# EAGLE design _FARTSNIFFER (EAGLE 6.1)
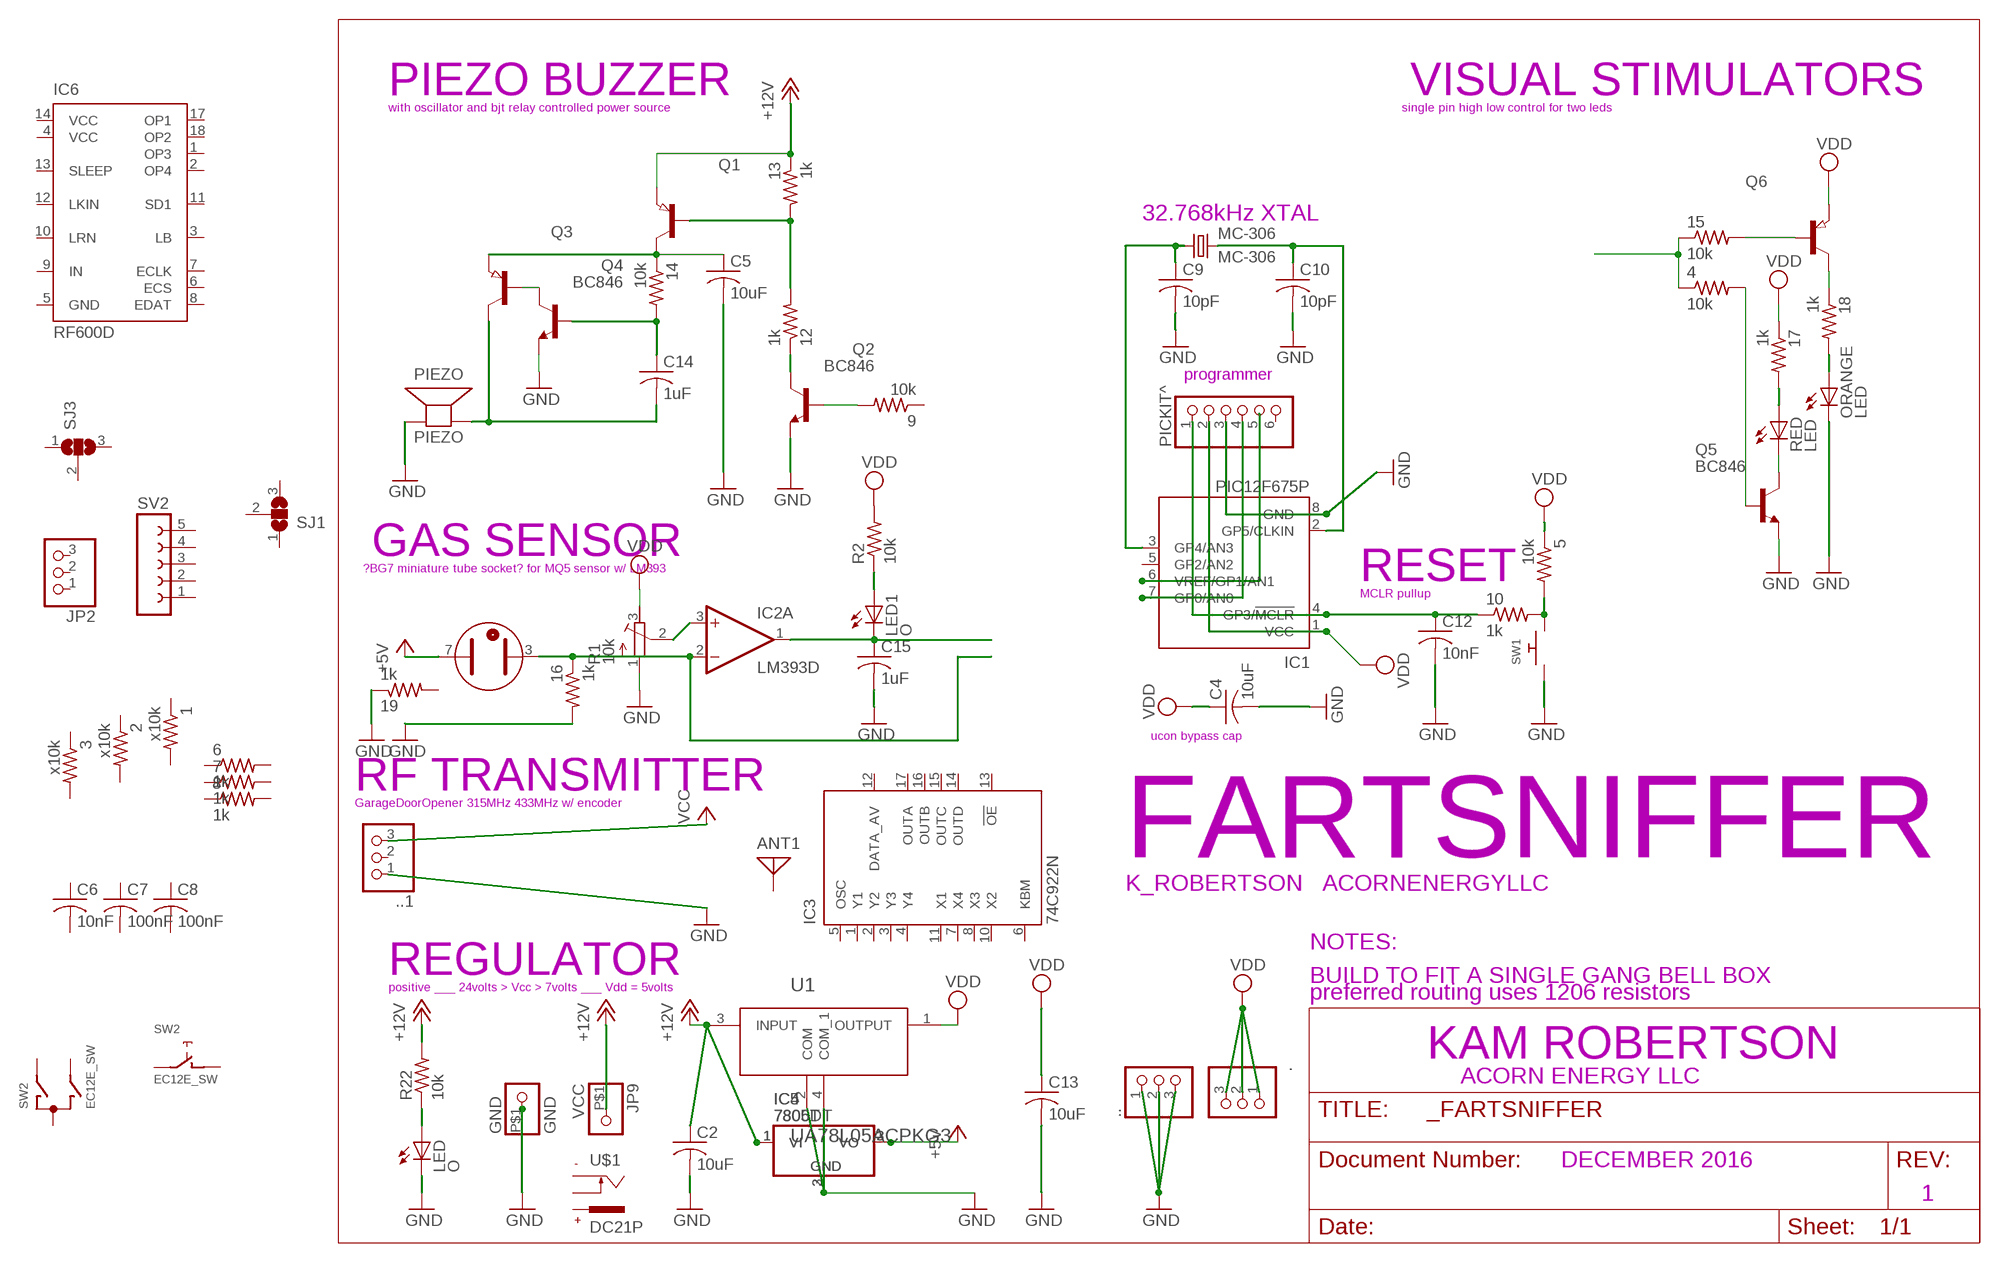
[diagram p0: schematic, sheet 1]

## Parts
1  x10k  R-US_R1206  [R1206]
2  x10k  R-US_R1206  [R1206]
3  x10k  R-US_R1206  [R1206]
4  10k  R-US_R1206  [R1206]
5  10k  R-US_R1206  [R1206]
6  1k  R-US_R1206  [R1206]
7  1k  R-US_R1206  [R1206]
8  1k  R-US_R1206  [R1206]
9  10k  R-US_R1206  [R1206]
10  1k  R-US_R1206  [R1206]
12  1k  R-US_R1206  [R1206]
13  1k  R-US_R1206  [R1206]
14  10k  R-US_R1206  [R1206]
15  10k  R-US_R1206  [R1206]
16  1k  R-US_R1206  [R1206]
17  1k  R-US_R1206  [R1206]
18  1k  R-US_R1206  [R1206]
19  1k  R-US_R1206  [R1206]
.  PINHD-1X3CB  [1X03-CLEANBIG]
..  PINHD-1X3CB  [1X03-CLEANBIG]
..1  PINHD-1X3CB  [1X03-CLEANBIG]
ANT1  ANTENNA  [PAD-01]
C2  10uF  C-USC1210  [C1210]
C4  10uF  C-USC1210  [C1210]
C5  10uF  C-USC1210  [C1210]
C6  10nF  C-USC1210  [C1210]
C7  100nF  C-USC1210  [C1210]
C8  100nF  C-USC1210  [C1210]
C9  10pF  C-USC1210  [C1210]
C10  10pF  C-USC1210  [C1210]
C12  10nF  C-USC1210  [C1210]
C13  10uF  C-USC1210  [C1210]
C14  1uF  C-USC1210  [C1210]
C15  1uF  C-USC1210  [C1210]
GND  GND  PINHD-1X1-BIGPOGO  [1X1-BIGPOGO]
IC1  PIC12F675P  [DIL8]
IC2  LM393D  [SO08]
IC3  74C922N  [DIL18]
IC4  7806DT  [TO252]
IC5  7805T  [TO220H]
IC6  RF600D  [DIL18]
JP2  PINHD-1X3CB  [1X03-CLEANBIG]
JP9  VCC  PINHD-1X1-BIGPOGO  [1X1-BIGPOGO]
LED  O  LEDCHIPLED_1206  [CHIPLED_1206]
LED1  O  LEDCHIPLED_1206  [CHIPLED_1206]
MC-306  MC-306  [MC-306]
ORANGE  LED  LED5MM  [LED5MM]
PICKIT^  PINHD-1X6LOCK  [1X06-BIGLOCK]
PIEZO  PIEZO  SPEAKER/AL60P  [AL60P]
Q1  PNP-TRANSISTOR_SOT89  [SOT89]
Q2  BC846  [SOT23]
Q3  PNP-TRANSISTOR_SOT89  [SOT89]
Q4  BC846  [SOT23]
Q5  BC846  [SOT23]
Q6  PNP-TRANSISTOR_SOT23  [SOT23]
R1  10k  R-TRIMM64W  [RTRIM64W]
R2  10k  R-US_R1206  [R1206]
R22  10k  R-US_R1206  [R1206]
RED  LED  LED5MM  [LED5MM]
SJ1  SJ2W  [SJ_2]
SJ3  SJ2W  [SJ_2]
ST1  STABI  [MINI_P]
SV2  FE05-1  [FE05-1]
SW1  SWITCH_PUSHBUTTONEVQ-PE  [TACT_PANA-EVQ]
SW2  EC12E_SW  [ALPS_EC12E_SW]
U1  UA78L05ACPKG3  [SOT150P400X160-4N]
U$1  DC21P  [DCSKTP]

## Nets
+5V: IC4.2(VO) IC5.3(VO)
+12V: 13.1 C2.1 IC4.1(VI) IC5.1(VI) JP9.P$1 Q1.3(E) R22.2 U1.3(INPUT)
GND: 16.2 19.1 ..1.1 ...1 ...2 ...3 C2.2 C4.2 C5.2 C9.2 C10.2 C12.2 C13.2 C15.2 GND.P$1 IC1.8(GND) IC4.3(GND) IC5.2(GND) LED.C ORANGE.K(C) PICKIT^.3 PIEZO.2(-) Q2.2(E) Q4.2(E) Q5.2(E) R1.1(A) SW1.P$1 U1.2(COM) U1.4(COM_1)
N$3: 9.2 Q2.1(B)
N$4: 5.2 10.2 SW1.P$2
N$5: 10.1 C12.1 IC1.4(GP3/!MCLR) PICKIT^.1
N$6: IC1.7(GP0/AN0) PICKIT^.4
N$7: IC1.6(VREF/GP1/AN1)
N$8: Q5.3(C) RED.K(C)
N$11: 12.1 Q2.3(C)
N$12: 12.2 13.2 Q1.1(B)
N$14: 4.2 Q5.1(B)
N$15: 18.1 Q6.3(C)
N$16: 15.2 Q6.1(B)
N$17: 4.1 15.1
N$18: 16.1 IC2.2(A:-IN) ST1.3(A)
N$19: IC2.3(A:+IN) R1.2(S)
N$20: LED1.A R2.1
N$21: Q3.1(B) Q4.3(C)
N$22: 14.1 C5.1 Q1.2(C) Q3.3(E)
N$23: 14.2 C14.1 Q4.1(B)
N$24: C15.1 IC2.1(A:OUT) LED1.C
N$28: 18.2 ORANGE.A
N$29: 17.2 RED.A
N$31: C9.1 IC1.3(GP4/AN3) MC-306.1
N$37: C10.1 IC1.2(GP5/CLKIN) MC-306.4
N$40: LED.A R22.1
VCC: ..1.3
VDD: 5.1 17.1 ..1 ..2 ..3 C4.1 C13.1 IC1.1(VCC) PICKIT^.2 Q6.2(E) R1.3(E) R2.2 ST1.7(K) U1.1(OUTPUT) ; supply symbol labelled +5V
VS: C14.2 PIEZO.1(+) Q3.2(C)
Unconnected: 1.1 1.2 2.1 2.2 3.1 3.2 6.1 6.2 7.1 7.2 8.1 8.2 9.1 19.2 ..1.2 ANT1.1 C6.1 C6.2 C7.1 C7.2 C8.1 C8.2 IC1.5(GP2/AN2) IC2.5(B:+IN) IC2.6(B:-IN) IC2.7(B:OUT) IC3.1(Y1) IC3.2(Y2) IC3.3(Y3) IC3.4(Y4) IC3.5(OSC) IC3.6(KBM) IC3.7(X4) IC3.8(X3) IC3.10(X2) IC3.11(X1) IC3.12(DATA_AV) IC3.13(!OE) IC3.14(OUTD) IC3.15(OUTC) IC3.16(OUTB) IC3.17(OUTA) IC6.1(OP3) IC6.2(OP4) IC6.3(LB) IC6.4(VCC) IC6.6(ECS) IC6.7(ECLK) IC6.8(EDAT) IC6.9(IN) IC6.10(LRN) IC6.11(SD1) IC6.12(LKIN) IC6.13(SLEEP) IC6.17(OP1) IC6.18(OP2) JP2.1 JP2.2 JP2.3 PICKIT^.5 PICKIT^.6 SJ1.1 SJ1.2 SJ1.3 SJ3.1 SJ3.2 SJ3.3 SV2.1 SV2.2 SV2.3 SV2.4 SV2.5 SW2.A SW2.B SW2.C SW2.D SW2.E SW2.GND1(G) SW2.GND2(G) U$1.+ U$1.- U$1.C

## Notes on the sheet
- PIEZO BUZZER | VISUAL STIMULATORS
- with oscillator and bjt relay controlled power source | single pin high low control for two leds
- 32.768kHz XTAL
- programmer
- GAS SENSOR
- ?BG7 miniature tube socket? for MQ5 sensor w/ LM393
- RESET
- MCLR pullup
- ucon bypass cap
- RF TRANSMITTER
- GarageDoorOpener 315MHz 433MHz w/ encoder
- FARTSNIFFER
- K_ROBERTSON   ACORNENERGYLLC
- NOTES:
- REGULATOR
- BUILD TO FIT A SINGLE GANG BELL BOX
- positive ___ 24volts > Vcc > 7volts ___ Vdd = 5volts
- preferred routing uses 1206 resistors
- KAM ROBERTSON
- ACORN ENERGY LLC
- DECEMBER 2016
- 1

## Power pins joined to a net without a drawn wire
GND: IC3.9(GND) IC6.5(GND)
V+: IC2.8(P:V+)
V-: IC2.4(P:V-)
VCC: IC3.18(VCC) IC6.14(VCC)

## Library data of the parts
1-10 12-19 R2 R22 = resistor:R-US_: RESISTOR, American symbol
. .. ..1 JP2 = adafruit:PINHD-1X3: PIN HEADER
ANT1 = discrete:ANTENNA: Antenna
C2 C4-C10 C12-C15 = adafruit:C-US: CAPACITOR, American symbol
GND JP9 = adafruit:PINHD-1X1: Pin header 1x1 for 0.1" spacing With round pins
IC1 = microchip:PIC12F675: 8-Pin FLASH-Based 8-Bit CMOS Microcontroller Precision Internal 4 MHz oscillator factory calibrated to ±1% Low Power Features: Standby Current: - 1 nA @ 2.0V, typical Operating Current: - 8.5µA @ 32 kHz, 2.0V, typical - 100µA @ 1 MHz, 2.0V, typical Watchdog Timer Current: - 300 nA @ 2.0V, typical Timer1 oscillator current: - 4µA @ 32 kHz, 2.0V, typical Analog-to-Digital Converter module: - 10-bit resolution - Programmable 4-channel input - Voltage reference input Source: http://www.microchip.com .. 41190E.pdf; MF: MICROCHIP; MPN: PIC12F675-E/P; OC_FARNELL: 9759018; OC_NEWARK: 92C4340
IC2 = linear:LM393: COMPARATOR
IC3 = 74xx-us:74C922: 16-Key Encoder Source: http://www.national.com/ds/MM/MM54C922.pdf#page=1
IC4 IC5 = linear:78*: Positive VOLTAGE REGULATOR Source: http://cache.national.com/ds/LM/LM78L05.pdf http://www.fairchildsemi.com/ds/LM/LM7805.pdf
IC6 = rf-solutions:RF600D: RF / IR Decoder Source: RF600D.pdf; MPN: RF600D; OC_FARNELL: 1200973; OC_NEWARK: 01M8597
LED LED1 ORANGE RED = adafruit:LED: LED OSRAM: - CHIPLED LG R971, LG N971, LY N971, LG Q971, LY Q971, LO R971, LY R971 LH N974, LH R974 LS Q976, LO Q976, LY Q976 LO Q996 - Hyper CHIPLED LW Q18S LB Q993, LB Q99A, LB R99A - SideLED LS A670, LO A670, LY A670, LG A670, LP A670 LB A673, LV A673, LT A673, LW A673 LH A674 LY A675 LS A676, LA A676, LO A676, LY A676, LW A676 LS A679, LY A679, LG A679 - Hyper Micro SIDELED® LS Y876, LA Y876, LO Y876, LY Y876 LT Y87S - SmartLED LW L88C, LW L88S LB L89C, LB L89S, LG L890 LS L89K, LO L89K, LY L89K LS L896, LA L896, LO L896, LY L896 - TOPLED LS T670, LO T670, LY T670, LG T670, LP T670 LSG T670, LSP T670, LSY T670, LOP T670, LYG T670 LG T671, LOG T671, LSG T671 LB T673, LV T673, LT T673, LW T673 LH T674 LS T676, LA T676, LO T676, LY T676, LB T676, LH T676, LSB T676, LW T676 LB T67C, LV T67C, LT T67C, LS T67K, LO T67K, LY T67K, LW E67C LS E67B, LA E67B, LO E67B, LY E67B, LB E67C, LV E67C, LT E67C LW T67C LS T679, LY T679, LG T679 LS T770, LO T770, LY T770, LG T770, LP T770 LB T773, LV T773, LT T773, LW T773 LH T774 LS E675, LA E675, LY E675, LS T675 LS T776, LA T776, LO T776, LY T776, LB T776 LHGB T686 LT T68C, LB T68C - Hyper Mini TOPLED® LB M676 - Mini TOPLED Santana® LG M470 LS M47K, LO M47K, LY M47K Source: http://www.osram.convergy.de/
MC-306 = crystal:MC-306: kHz RANGE CRYSTAL UNIT SMD Source: MC-306_405_406_E07X.PDF Homepage <http://www.epsontoyocom.co.jp>; MPN: MC-306 60.0KHZ 100PPM ,12.5PF; OC_FARNELL: 1278040; OC_NEWARK: 31M5576
PICKIT^ = adafruit:PINHD-1X6: PIN HEADER
PIEZO = adafruit:SPEAKER: SPEAKER Source: Buerklin Added PS12 (for part # PS1240 piezo) http://www.ladyada.net/library/pcb/eaglelibrary.html
Q1 Q3 Q6 = semicon-smd-ipc:PNP-TRANSISTOR_: PNP TRANSISTOR
Q2 Q4 Q5 = transistor-neu-to92:BC846: NPN TRANSISTOR
R1 = resistor:R-TRIMM: Trimm resistor
SJ1 SJ3 = jumper:SJ2W: SMD solder JUMPER
ST1 = valves2:STABI
SV2 = con-lsta:FE05-1: FEMALE HEADER; OC_FARNELL: unknown; OC_NEWARK: unknown
SW1 = adafruit:SWITCH_PUSHBUTTON: Buttons SOFTTOUCHSMD_SJ - Soft touch temporary push button (Super Junk Akihabara) Compatible with SKPMANE010 [Mouser: 688-SKPMAN] C&K_KSS = Digikey: KSS221GLFS
SW2 = switch-alps:EC12E_SW: ALPS rotary Encoder EC12E series with switch; MPN: EC12E2424407; OC_FARNELL: 1520813; OC_NEWARK: 74M1068
U1 = TI-Eagle_library:UA78L05: μA78L00 SERIES POSITIVE-VOLTAGE REGULATORS,SOT-89-3; MPN: UA78L05ACPKG3; OC_FARNELL: 1236590; OC_NEWARK: 13M5626; PACKAGE: SOT-89-3; SUPPLIER: TEXAS INSTRUMENTS
U$1 = dcsocket:DC21P: DC 2.1 mm Power Socket Positive Centre

## Board
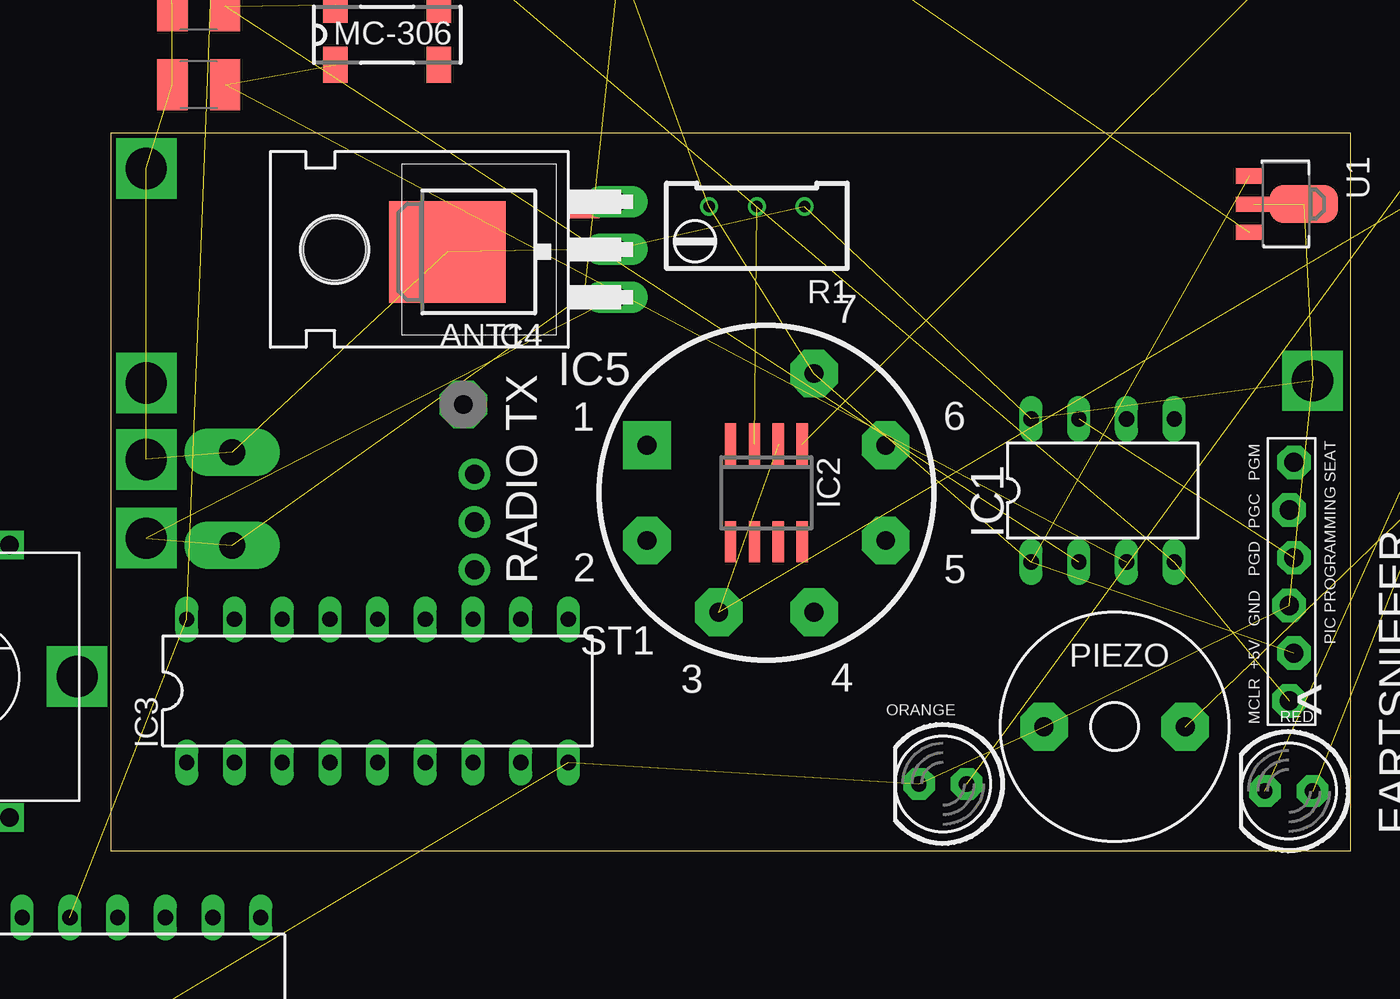
[diagram p1: board, top side]
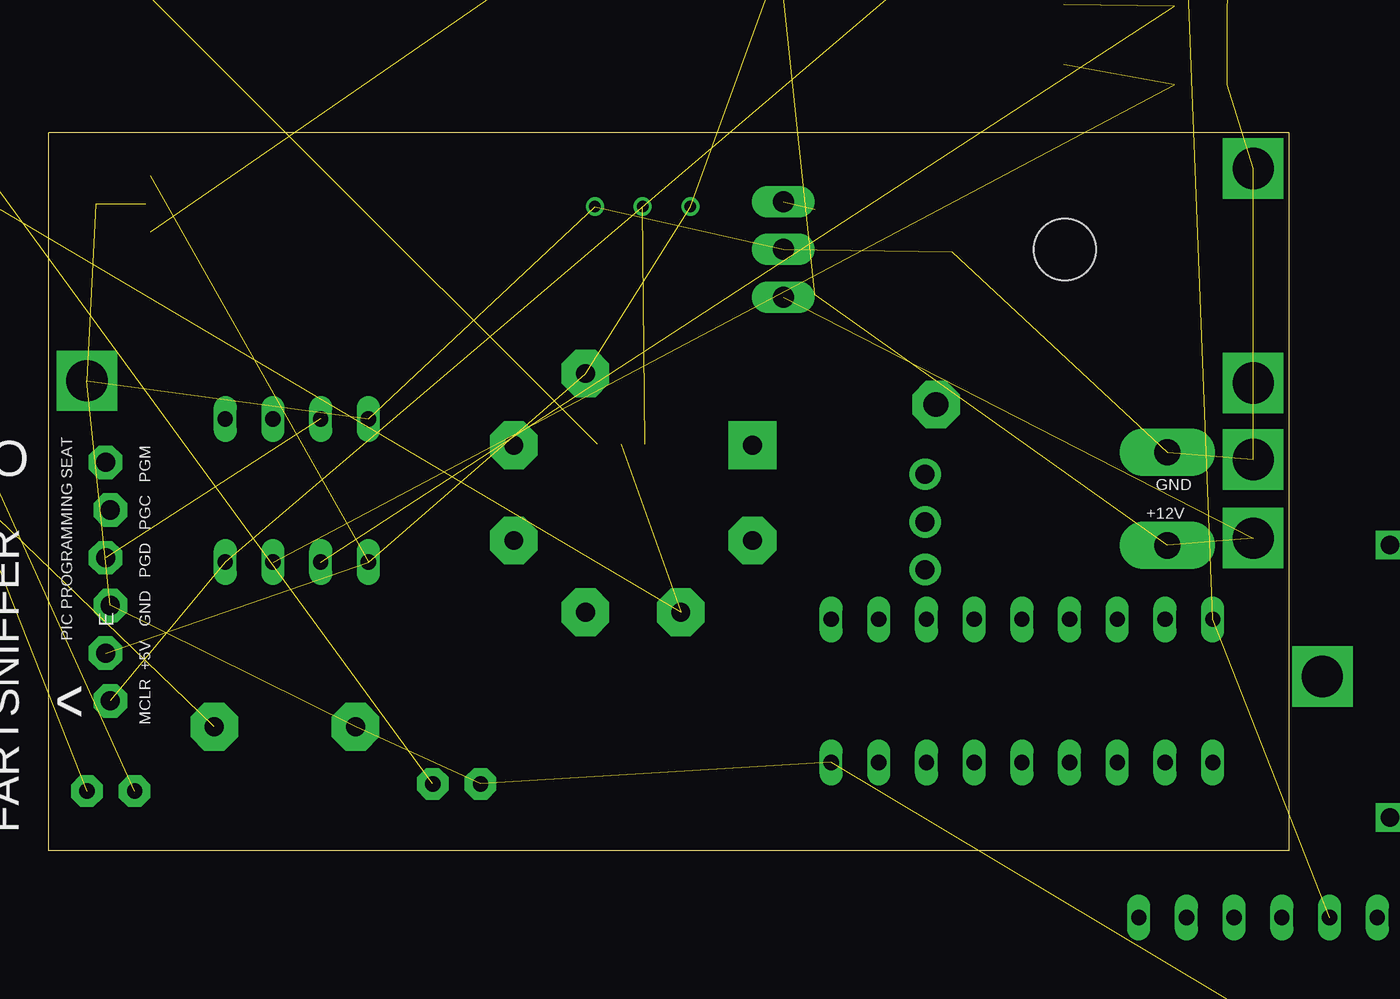
[diagram p2: board, bottom side, seen from below]

Size 66.04 x 38.23 mm. Coordinates in mm from the lower left corner, seen from the top.
Outline: 0,0 0,38.23 66.04,38.23 66.04,0 0.01,0
Copper layers (1*16): Top 0.0356mm / dielectric 1.5011mm / Bottom 0.0356mm
Design rules: minimum track width 13mil, minimum drill 13mil, track to track 13mil, track to pad 13mil, pad to pad 13mil, via to via 13mil, smd to smd 13mil, copper to edge 15mil, drill to drill 6mil, minimum pad ring 7mil, minimum via ring 7mil, stop-mask expansion 2.5mil, vias tented up to drill 0mil, thermal gap 10mil
Holes 1.6 mm at 77.09,25.02 89.53,19.56
tRestrict: area 30.4,5.8 to 33,8
bRestrict: area 30.4,5.8 to 33,8

### Footprints (pad centres in the part's own frame; a part is rotated, then mirrored left to right if it is on the bottom)
R1206 = smd 1.6 x 1.803: 1 -1.422,0; 2 1.422,0
1X03-CLEANBIG = drill 1.016 pad 1.676: 1 -2.54,0; 2 0,0; 3 2.54,0
PAD-01 = drill 1.321 pad 2.54 octagon: 1 0,0
C1210 = smd 1.6 x 2.7: 1 -1.4,0; 2 1.4,0
1X1-BIGPOGO = drill 1.4 pad 2.54 long: P$1 0,0
DIL8 = drill 0.813 long: 1 -3.81,-3.81; 2 -1.27,-3.81; 3 1.27,-3.81; 4 3.81,-3.81; 5 3.81,3.81; 6 1.27,3.81; 7 -1.27,3.81; 8 -3.81,3.81
SO08 = smd 0.6 x 2.2: 1 -1.905,-2.6; 2 -0.635,-2.6; 3 0.635,-2.6; 4 1.905,-2.6; 5 1.905,2.6; 6 0.635,2.6; 7 -0.635,2.6; 8 -1.905,2.6
DIL18 = drill 0.813 long: 1 -10.16,-3.81; 2 -7.62,-3.81; 3 -5.08,-3.81; 4 -2.54,-3.81; 5 0,-3.81; 6 2.54,-3.81; 7 5.08,-3.81; 8 7.62,-3.81; 9 10.16,-3.81; 10 10.16,3.81; 11 7.62,3.81; 12 5.08,3.81; 13 2.54,3.81; 14 0,3.81; 15 -2.54,3.81; 16 -5.08,3.81; 17 -7.62,3.81; 18 -10.16,3.81
TO252 = smd 1 x 1.6: 1 -2.28,-4.8; 2 2.28,-4.8 | smd 5.4 x 6.2: 3 0,2.5
TO220H = drill 1.118 long: 1 -2.54,-10.16; 2 0,-10.16; 3 2.54,-10.16 | hole 3.302: 0,4.826
CHIPLED_1206 = smd 1.5 x 1.5: A 0,-1.75; C 0,1.75
MC-306 = smd 1.3 x 1.9: 1 -2.75,-1.6; 2 2.75,-1.6; 3 2.75,1.6; 4 -2.75,1.6
LED5MM = drill 0.813 pad 1.676 octagon: A -1.27,0; K 1.27,0
1X06-BIGLOCK = drill 1.016 pad 1.778 octagon: 1 -6.35,0.127; 2 -3.81,-0.127; 3 -1.27,0.127; 4 1.27,-0.127; 5 3.81,0.127; 6 6.35,-0.127
AL60P = drill 1.016 pad 2.54 octagon: 1 -3.759,0; 2 3.759,0
SOT89 = smd 0.8 x 1.4: 1 -1.499,-1.981; 3 1.499,-1.981 | smd 0.8 x 1.9: 2 0,-1.727 | smd 2.032 x 3.65: 2@1 0,0.94
SOT23 = smd 1 x 1.4: 1 -0.95,-1.1; 2 0.95,-1.1; 3 0,1.1
RTRIM64W = drill 0.61: 1 1.27,-2.54; 2 1.27,0; 3 1.27,2.54
SJ_2 = smd 1.168 x 1.6: 1 -1.524,0; 2 0,0; 3 1.524,0
MINI_P = drill 1 pad 2.54 square: 1 6.35,-2.54 | drill 1 pad 2.54 octagon: 2 6.35,2.54; 3 2.54,6.35; 4 -2.54,6.35; 5 -6.35,2.54; 6 -6.35,-2.54; 7 -2.54,-6.35
FE05-1 = drill 0.813 long: 1 -5.08,0; 2 -2.54,0; 3 0,0; 4 2.54,0; 5 5.08,0
TACT_PANA-EVQ = drill 1.3 pad 2.54: P$1 -3.25,0; P$2 3.25,0
ALPS_EC12E_SW = drill 1 square: A -2.5,-7.5; B 2.5,-7.5; C 0,-7.5; D -2.5,7; E 2.5,7 | drill 2.2 square: GND1 -6.1,0; GND2 6.1,0
SOT150P400X160-4N = smd 0.8 x 1.4: 1 -1.499,-1.981; 3 1.499,-1.981 | smd 0.8 x 1.9: 2 0,-1.727 | smd 2.032 x 3.65: 4 0,0.94
DCSKTP = drill 0.813 pad 2.54 long: + -1.27,0.08; - -1.27,6.08; C 3.63,3.13

### Placement (x,y rotation side)
1  90.55,68.33 0 bottom  (outside the outline)
2  95.89,72.39 180 top  (outside the outline)
3  91.06,61.09 180 top  (outside the outline)
4  64.39,78.11 0 top  (outside the outline)
5  33.27,76.07 0 top  (outside the outline)
6  97.41,51.31 180 top  (outside the outline)
7  96.01,69.34 180 top  (outside the outline)
8  96.52,57.78 180 top  (outside the outline)
9  44.2,63.5 180 bottom  (outside the outline)
10  4.83,60.71 0 top  (outside the outline)
12  35.31,55.24 180 bottom  (outside the outline)
13  35.31,52.45 180 bottom  (outside the outline)
14  85.72,76.07 0 top  (outside the outline)
15  55.12,77.09 0 top  (outside the outline)
16  91.57,46.86 0 top  (outside the outline)
17  90.55,74.04 0 top  (outside the outline)
18  96.27,74.8 0 top  (outside the outline)
19  90.68,56.77 0 top  (outside the outline)
.  24.64,56.77 90 top  (outside the outline)
..  21.84,56.77 270 top  (outside the outline)
..1  8.64,65.02 180 top  (outside the outline)
ANT1  18.8,23.75 0 top
C2  26.14,51.31 0 bottom  (outside the outline)
C4  46.23,67.18 0 bottom  (outside the outline)
C5  3.68,55.63 0 bottom  (outside the outline)
C6  97.41,54.36 180 bottom  (outside the outline)
C7  96.14,65.91 180 bottom  (outside the outline)
C8  96.39,61.47 180 bottom  (outside the outline)
C9  4.7,40.77 180 top
C10  4.7,44.96 180 top  (outside the outline)
C12  46.86,66.04 0 top  (outside the outline)
C13  23.27,62.26 0 bottom  (outside the outline)
C14  91.06,64.14 0 top  (outside the outline)
C15  91.06,52.83 0 top  (outside the outline)
GND  6.48,21.21 0 bottom
IC1  52.83,19.18 0 top
IC2  34.92,19.05 180 top
IC3  14.22,8.51 0 top
IC4  20.45,31.88 90 top
IC5  16.76,32 90 top
IC6  -2.16,-7.37 0 top  (outside the outline)
JP2  19.38,17.5 90 top
JP9  6.48,16.26 180 bottom
LED  23.24,61.85 90 top  (outside the outline)
LED1  86.61,69.6 0 top  (outside the outline)
MC-306  14.73,43.43 0 top  (outside the outline)
ORANGE  44.32,3.56 180 top
PICKIT^  62.89,14.33 90 top
PIEZO  53.47,6.6 180 top
Q1  36.96,49.4 270 bottom  (outside the outline)
Q2  35.31,58.42 270 bottom  (outside the outline)
Q3  96.9,46.48 0 top  (outside the outline)
Q4  76.71,77.22 0 top  (outside the outline)
Q5  87.76,60.2 0 top  (outside the outline)
Q6  71.25,77.98 0 top  (outside the outline)
R1  34.42,33.02 90 top
R2  91.44,49.4 0 top  (outside the outline)
R22  28.65,59.23 0 top  (outside the outline)
RED  62.74,3.17 180 top
SJ1  9.91,76.33 90 bottom  (outside the outline)
SJ3  30.99,55.5 180 top  (outside the outline)
ST1  34.92,19.05 180 top
SV2  66.29,66.17 180 top  (outside the outline)
SW1  42.8,76.96 0 top  (outside the outline)
SW2  -7.87,9.27 0 top
U1  62.61,34.42 270 top
U$1  20.95,76.33 90 top  (outside the outline)

### Tracks (layer width: path | path; a pad name or v marks a point on that pad's centre or on a via)
+5V  (1 unrouted)
+12V  (via drill 2.2)  (8 unrouted)
  other vias: 1.91,16.64
GND  (via drill 2.2)  (34 unrouted)
  other vias: 1.91,24.89 64.01,25.02 1.91,20.83 1.91,36.32
N$3  (1 unrouted)
N$4  (2 unrouted)
N$5  (3 unrouted)
N$6  (1 unrouted)
N$8  (1 unrouted)
N$11  (1 unrouted)
N$12  (2 unrouted)
N$14  (1 unrouted)
N$15  (1 unrouted)
N$16  (1 unrouted)
N$17  (1 unrouted)
N$18  (2 unrouted)
N$19  (1 unrouted)
N$20  (1 unrouted)
N$21  (1 unrouted)
N$22  (3 unrouted)
N$23  (2 unrouted)
N$24  (2 unrouted)
N$28  (1 unrouted)
N$29  (1 unrouted)
N$31  (2 unrouted)
N$37  (2 unrouted)
N$40  (1 unrouted)
VCC  (2 unrouted)
VDD  (13 unrouted)
VS  (2 unrouted)

### Text on the board
tPlace: GND | 32768Hz | ROTARY ENCODER KY-040 | ACORN ENERGY LLC Ver3 ECE411 NOVERMBER2016 | TUNING FORK XTAL | - | + | 10pF | - | + | - | + | - | + | SSOP | + | - | 10pF | GND | +5V | SW | DT | CLK | RED1k | LED | SW1k | GND | +5V | 10k | RX | PIC16F648A | GREEN1k | GND | +5V | RX | 1k | LED | TX | CLK1k | CLKpullup10k | 1k | GND | +5V | +5V? | RELAY? | TX | *RB3 | DT1k | DTpullup10k | GND | 1k | +5V | 1uF | SCRATCH N' SNIFF | ^ | PIC12F675 | GND | +9v | VOL.CON. | MCLRpullup10k | SolderBridge | KAM ACORNENERGYLLC | PIC PROGRAMMING SEAT | PGM | PGC | FARTSNIFFER | PGD | RADIO TX | GND | +5V | ^ | MCLR
bPlace: ROTARY ENCODER KY-040 | ACORN ENERGY LLC Ver3 ECE411 NOVERMBER2016 | RED | 10uF | GREEN | GND | POS | GND | POS | GND | POS | RA2_10k_BJT_RELAY | 1k | GND | +5V | SW | DT | CLK | 10uF | *RA3_1k | SWpullup10k | GND | +5v | NPN | SW10nF | B | *RA4_1k | ACORN_ENERGY_LLC | GND | +5v | C | OUT | E | RX | GND | CLK100nF | GND | +5v | 1k | TX | VOL.CON. | IN | 10uF | GND | 10uF | 1k | GND | DT100nF | B | SCRATCH N' SNIFF | ^ | LM386 | C | 10uF | E | PNP | KAM ACORNENERGYLLC | ! | PGM | PIEZO | GND | PGC | +12V | FARTSNIFFER | PGD | GND | E | +5V | PIC PROGRAMMING SEAT | MCLR | ^
Notes: HAPPY HOLIDAYS FROM: | HERBERT_the_ROOSTER | and TURKEY_the_ROOSTER